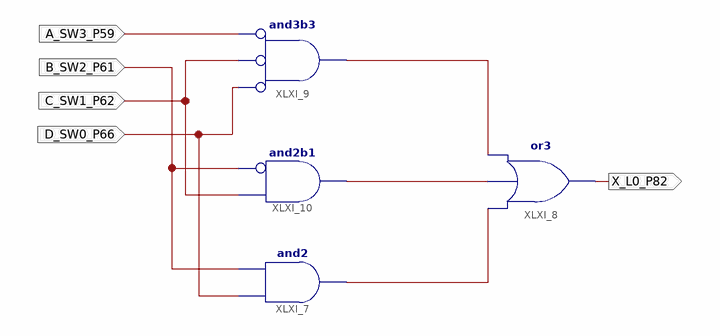
[diagram p0: schematic sheet 1]
// Xilinx ISE schematic full.sch (spartan6) as structural Verilog: 4 symbols, 5 ports
module full (
  input  A_SW3_P59,
  input  C_SW1_P62,
  input  D_SW0_P66,
  input  B_SW2_P61,
  output X_L0_P82
);

  wire XLXN_4, XLXN_5, XLXN_6;

  and XLXI_7 (XLXN_6, D_SW0_P66, B_SW2_P61);
  or XLXI_8 (X_L0_P82, XLXN_6, XLXN_5, XLXN_4);
  and XLXI_9 (XLXN_4, ~D_SW0_P66, ~C_SW1_P62, ~A_SW3_P59);  // and3b3
  and XLXI_10 (XLXN_5, ~B_SW2_P61, C_SW1_P62);  // and2b1
endmodule
